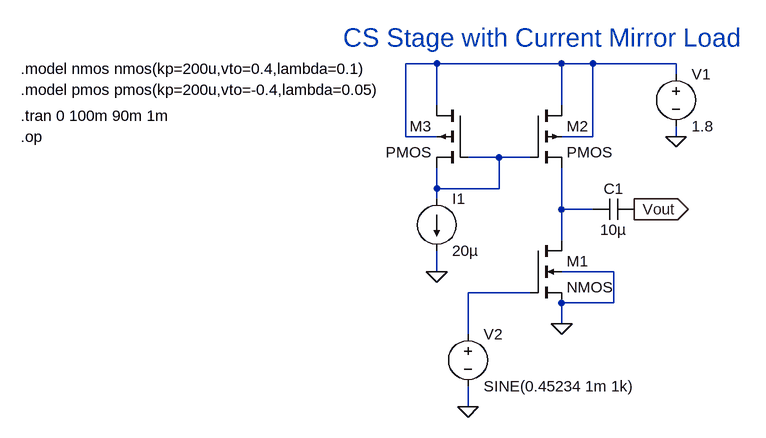
[diagram p0: schematic Current_Mirror_Load.asc]
Current_Mirror_Load.asc, the LTspice schematic file:
Version 4
SHEET 1 880 680
WIRE 48 -144 0 -144
WIRE 240 -144 48 -144
WIRE 288 -144 240 -144
WIRE 416 -144 288 -144
WIRE 416 -128 416 -144
WIRE 48 -80 48 -144
WIRE 240 -80 240 -144
WIRE 0 -32 0 -144
WIRE 48 -32 0 -32
WIRE 288 -32 288 -144
WIRE 288 -32 240 -32
WIRE 416 -32 416 -48
WIRE 144 0 96 0
WIRE 192 0 144 0
WIRE 48 48 48 16
WIRE 144 48 144 0
WIRE 144 48 48 48
WIRE 48 64 48 48
WIRE 240 80 240 16
WIRE 288 80 240 80
WIRE 240 128 240 80
WIRE 48 176 48 144
WIRE 320 176 240 176
WIRE 192 208 96 208
WIRE 320 224 320 176
WIRE 320 224 240 224
WIRE 240 256 240 224
WIRE 96 272 96 208
WIRE 96 384 96 352
FLAG 240 256 0
FLAG 416 -32 0
FLAG 48 176 0
FLAG 96 384 0
FLAG 352 80 Vout
IOPIN 352 80 Out
SYMBOL nmos4 192 128 R0
SYMATTR InstName M1
SYMATTR Value2 l=10u w=703u
SYMBOL pmos4 192 -80 R0
SYMATTR InstName M2
SYMATTR Value2 l=10u w=10u
SYMBOL pmos4 96 -80 M0
SYMATTR InstName M3
SYMATTR Value2 l=10u w=10u
SYMBOL current 48 64 R0
WINDOW 123 0 0 Left 0
WINDOW 39 0 0 Left 0
SYMATTR InstName I1
SYMATTR Value 20µ
SYMBOL voltage 416 -144 R0
WINDOW 123 0 0 Left 0
WINDOW 39 0 0 Left 0
SYMATTR InstName V1
SYMATTR Value 1.8
SYMBOL voltage 96 256 R0
WINDOW 123 0 0 Left 0
WINDOW 39 0 0 Left 0
SYMATTR InstName V2
SYMATTR Value SINE(0.45234 1m 1k)
SYMBOL cap 352 64 R90
WINDOW 0 0 32 VBottom 2
WINDOW 3 32 32 VTop 2
SYMATTR InstName C1
SYMATTR Value 10µ
TEXT -592 -136 Left 2 !.model nmos nmos(kp=200u,vto=0.4,lambda=0.1)
TEXT -592 -104 Left 2 !.model pmos pmos(kp=200u,vto=-0.4,lambda=0.05)
TEXT -592 -64 Left 2 !.tran 0 100m 90m 1m
TEXT -592 -32 Left 2 !.op
TEXT -96 -184 Left 4 ;CS Stage with Current Mirror Load

The netlist it stands for:
* Current_Mirror_Load.asc
M1 N003 N004 0 0 NMOS l=10u w=703u
M2 N001 N002 N003 N001 PMOS l=10u w=10u
M3 N001 N002 N002 N001 PMOS l=10u w=10u
I1 N002 0 20µ
V1 N001 0 1.8
V2 N004 0 SINE(0.45234 1m 1k)
C1 Vout N003 10µ
.model NMOS NMOS
.model PMOS PMOS
.lib standard.mos
.model nmos nmos(kp=200u,vto=0.4,lambda=0.1)
.model pmos pmos(kp=200u,vto=-0.4,lambda=0.05)
.tran 0 100m 90m 1m
.op
* CS Stage with Current Mirror Load
.backanno
.end